# Altium schematic sheet main.SchDoc
size A4; SheetNumber: 1; SheetTotal: 5
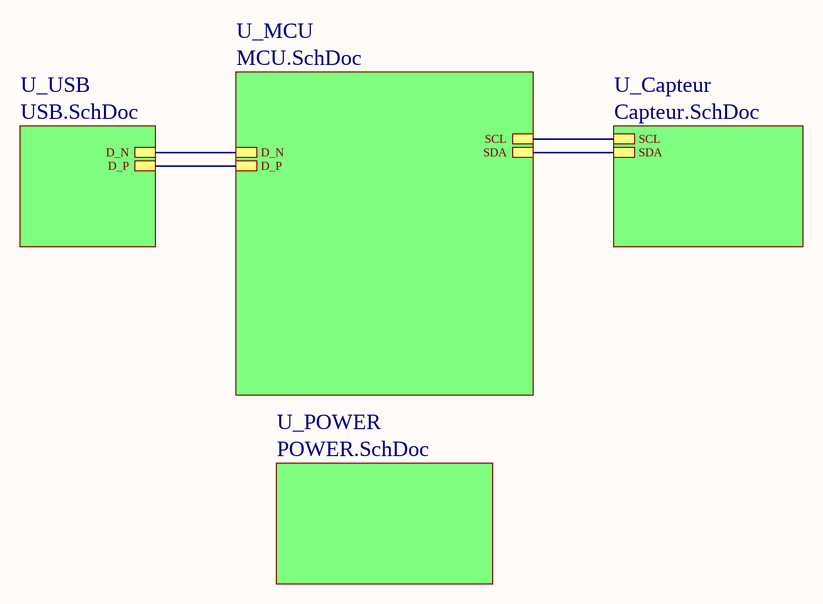
[diagram p0: main.SchDoc]

## Sub-sheets
U_Capteur = Capteur.SchDoc: SCL, SDA
U_MCU = MCU.SchDoc: SDA, SCL, D_N, D_P
U_POWER = POWER.SchDoc: no entries
U_USB = USB.SchDoc: D_N, D_P

## Nets
(unnamed): sheet U_MCU/SDA, sheet U_Capteur/SDA
(unnamed): sheet U_MCU/SCL, sheet U_Capteur/SCL
(unnamed): sheet U_MCU/D_N, sheet U_USB/D_N
(unnamed): sheet U_MCU/D_P, sheet U_USB/D_P